# EAGLE schematic components (EAGLE 9.6.1)
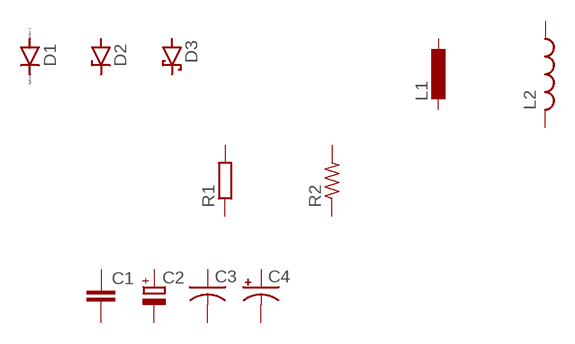
[diagram p0: schematic, sheet 1]

## Parts
C1  C-EU025-024X044  [C025-024X044]
C2  CPOL-EUB45181C  [B45181C]
C3  C-US025-024X044  [C025-024X044]
C4  CPOL-USB45181A  [B45181A]
D1  1N4004  [DO41-10]
D2  BZX55  [DO35Z10]
D3  1N5819-B  [DO41-7.6]
L1  L-EUIR-2  [IR-2]
L2  L-US0204V  [0204V]
R1  R-EU_0207/10  [0207/10]
R2  R-US_0204/7  [0204/7]
Unconnected: C1.1 C1.2 C2.+ C2.- C3.1 C3.2 C4.+ C4.- D1.A D1.C D2.A D2.C D3.A D3.C L1.1 L1.2 L2.1 L2.2 R1.1 R1.2 R2.1 R2.2

## Library data of the parts
C1 = rcl:C-EU: CAPACITOR, European symbol; SPICEPREFIX: C
C2 = rcl:CPOL-EU: POLARIZED CAPACITOR, European symbol; SPICEPREFIX: C
C3 = rcl:C-US: CAPACITOR, American symbol; SPICEPREFIX: C
C4 = rcl:CPOL-US: POLARIZED CAPACITOR, American symbol; SPICEPREFIX: C
D1 = diode:1N4004: DIODE general purpose rectifier, 1 A
D2 = diode:BZX55: Z DIODE
D3 = diode:1N581*: 1.0A SCHOTTKY BARRIER RECTIFIER Source: http://www.diodes.com/datasheets/ds23001.pdf
L1 = rcl:L-EU: INDUCTOR, European symbol; SPICEPREFIX: L
L2 = rcl:L-US: INDUCTOR, American symbol; SPICEPREFIX: L
R1 = rcl:R-EU_: RESISTOR, European symbol; SPICEPREFIX: R
R2 = rcl:R-US_: RESISTOR, American symbol; SPICEPREFIX: R